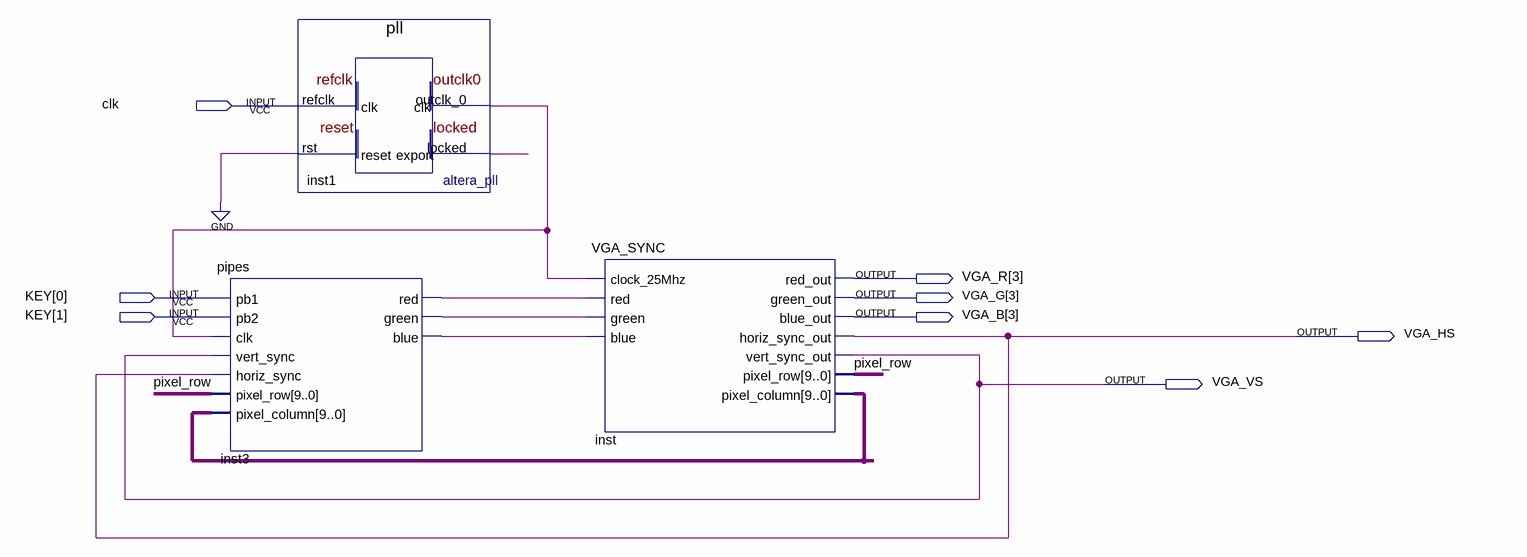
[diagram p0: schematic sheet]
// Quartus schematic Flappybirds_Top.bdf as structural Verilog: 3 symbols, 8 pins
module Flappybirds_Top (
  input  clk,
  input  [1:0] KEY,
  output [3:3] VGA_R,
  output [3:3] VGA_G,
  output [3:3] VGA_B,
  output VGA_HS,
  output VGA_VS
);

  wire inst1_locked, inst1_outclk_0, inst3_blue, inst3_green, inst3_red, pixel_row;
  wire [9:0] inst_pixel_column;

  pipes inst3 (
    .clk(inst1_outclk_0), .vert_sync(VGA_VS), .horiz_sync(VGA_HS), .pixel_row({10{pixel_row}}),
    .pixel_column(inst_pixel_column), .red(inst3_red), .green(inst3_green), .blue(inst3_blue));  // open: pb1, pb2
  pll inst1 (.refclk(clk), .rst(1'b0), .outclk_0(inst1_outclk_0), .locked(inst1_locked));
  VGA_SYNC inst (
    .clock_25Mhz(inst1_outclk_0), .red(inst3_red), .green(inst3_green), .blue(inst3_blue),
    .red_out(VGA_R[3]), .green_out(VGA_G[3]), .blue_out(VGA_B[3]), .horiz_sync_out(VGA_HS),
    .vert_sync_out(VGA_VS), .pixel_row(pixel_row), .pixel_column(inst_pixel_column));
endmodule
